# EAGLE design Servo_V1.0 (EAGLE 9.4.1)
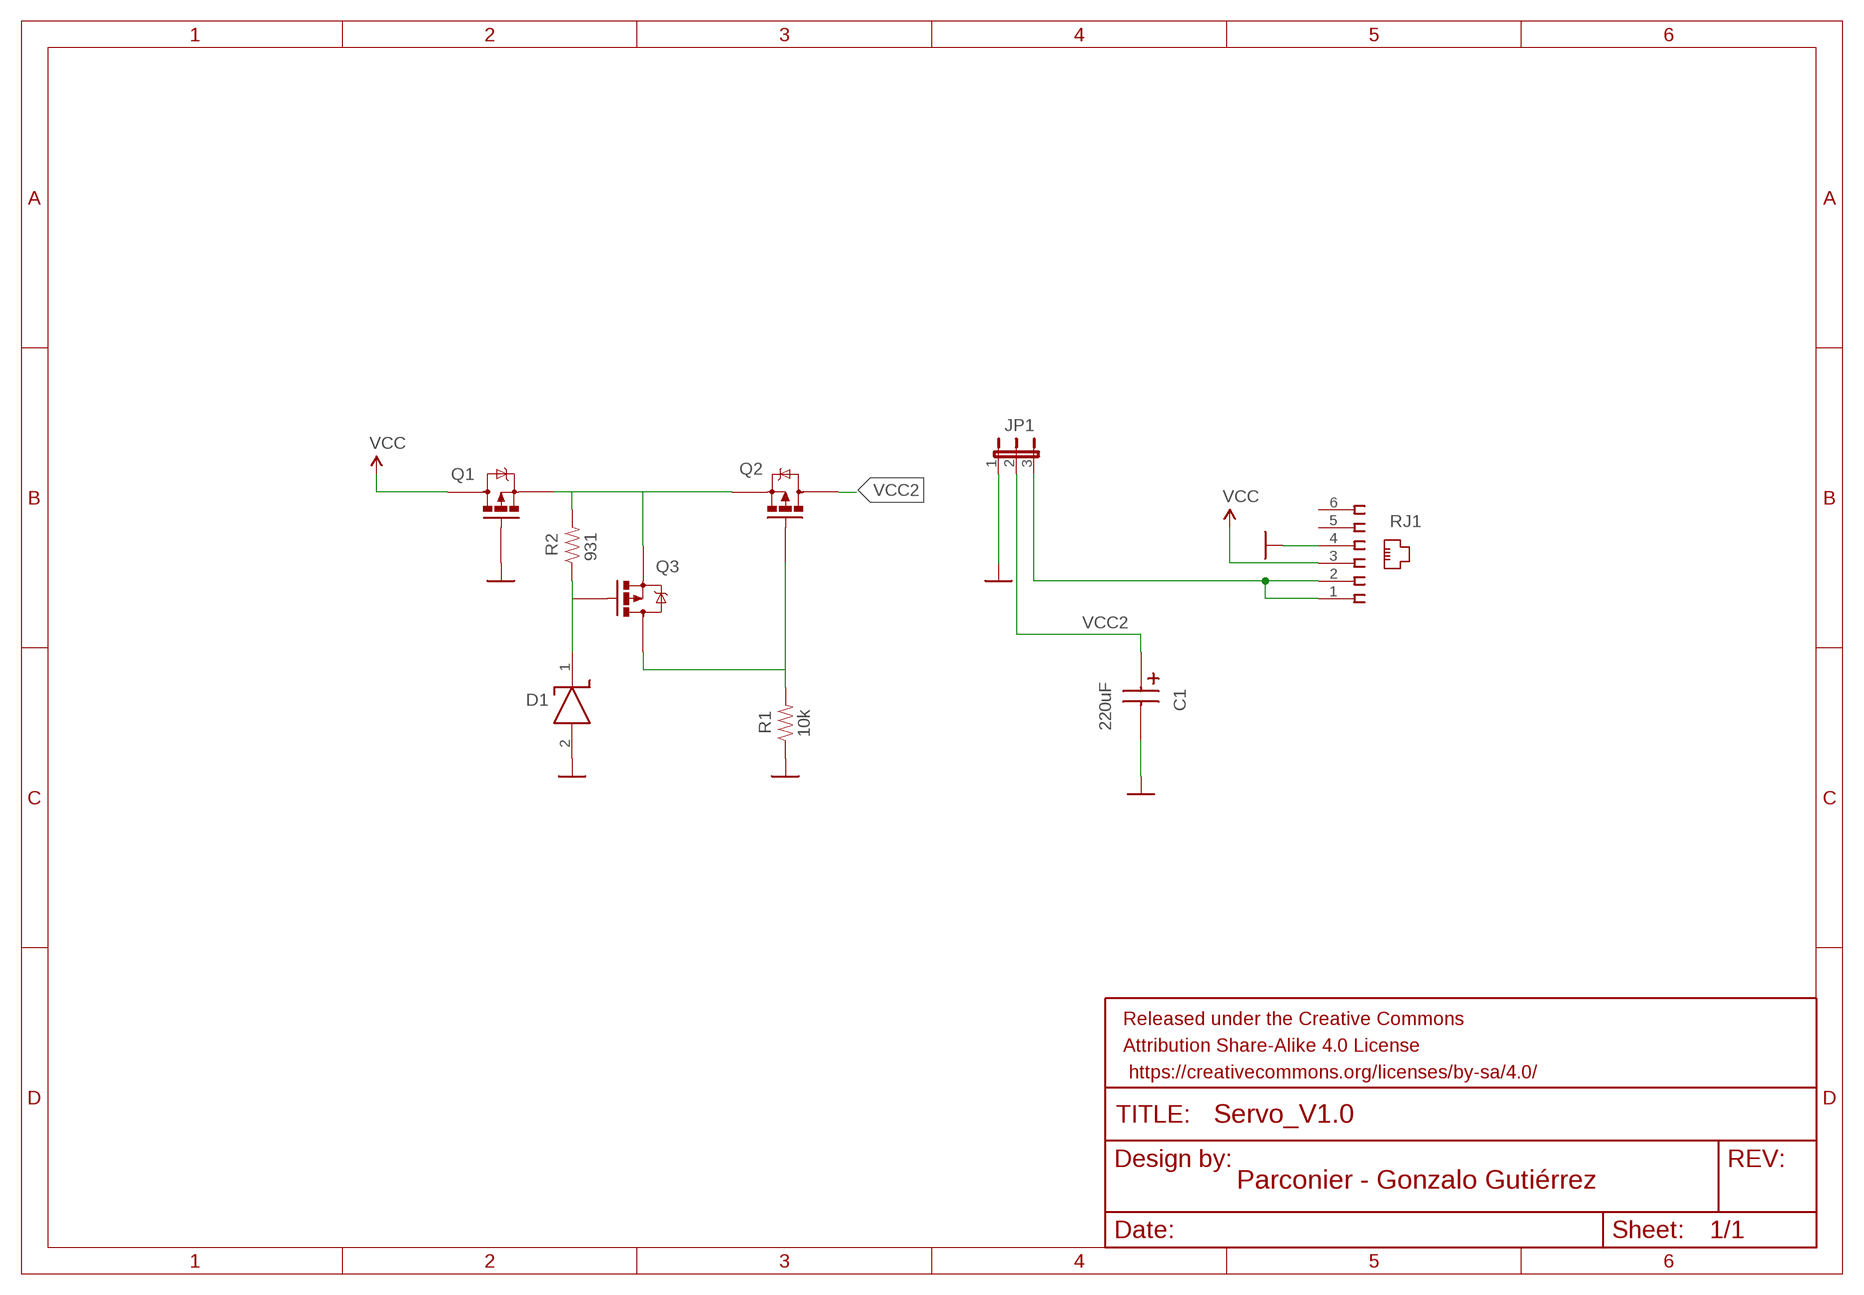
[diagram p0: schematic, sheet 1]

## Parts
C1  220uF  860010372006  [CAPPRD200W80D500H1100]
D1  BZT52C5V1-7-F  [SOD3716X145N]
JP1  JP2E  [JP2]
Q1  IRLML2244TRPBF  [SOT95P237X112-3N]
Q2  IRLML2244TRPBF  [SOT95P237X112-3N]
Q3  IRLML2244TRPBF  [SOT95P237X112-3N]
R1  10k  RES_0402  [RESC1005X35]
R2  931  RES_0402  [RESC1005X35]
RJ1  615006138421  [615006138421]

## Nets
GND: C1.2(-) D1.2(A) JP1.1 Q1.1(G) R1.1 RJ1.4
N$1: Q1.2(S) Q2.2(S) Q3.2(S) R2.2
N$2: Q2.1(G) Q3.3(D) R1.2
N$3: JP1.3 RJ1.1 RJ1.2
N$4: D1.1(K) Q3.1(G) R2.1
VCC: Q1.3(D) RJ1.3
VCC2: C1.1(+) JP1.2 Q2.3(D)
Unconnected: RJ1.5 RJ1.6

## Library data of the parts
C1 = 860010372006:860010372006: Wurth Elektronik 100uF 16 V dc Aluminium Electrolytic Capacitor, WCAP-ATG8 Series 2000h 5 (Dia.) x 11mm Source: Datasheet <http://uk.rs-online.com/web/p/products/1636051>; DESCRIPTION: Wurth Elektronik 100uF 16 V dc Aluminium Electrolytic Capacitor, WCAP-ATG8 Series 2000h 5 (Dia.) x 11mm; HEIGHT: 11mm; MANUFACTURER_NAME: Wurth Elektronik; MANUFACTURER_PART_NUMBER: 860010372006; MPN: 227CKS010M
D1 = BZT52C5V1-7-F:BZT52C5V1-7-F: Zener Diode 5.1V 5.8% 500mW SOD123 Diodes Inc BZT52C5V1-7-F Zener Diode, 5.1V 6% 0.5 W SMT 2-Pin SOD-123 Source: Datasheet <https://componentsearchengine.com/Datasheets/2/BZT52C5V1-7-F.pdf>; ALLIED_NUMBER: 71028127; ALLIED_PRICE/STOCK: https://www.alliedelec.com/diodes-inc-bzt52c5v1-7-f/71028127/; ARROW_PART_NUMBER: BZT52C5V1-7-F; ARROW_PRICE/STOCK: https://www.arrow.com/en/products/bzt52c5v1-7-f/diodes-incorporated; DESCRIPTION: Zener Diode 5.1V 5.8% 500mW SOD123 Diodes Inc BZT52C5V1-7-F Zener Diode, 5.1V 6% 0.5 W SMT 2-Pin SOD-123; HEIGHT: 1.45mm; MANUFACTURER_NAME: Diodes Inc.; MANUFACTURER_PART_NUMBER: BZT52C5V1-7-F; MPN: BZT52C5V1-7-F; RS_PART_NUMBER: 7384951P; RS_PRICE/STOCK: http://uk.rs-online.com/web/p/products/7384951P
JP1 = jump_byme:JP2E; MPN: 5-146284-3; SPICEPREFIX: J
Q1-Q3 = IRLML2244TRPBF:IRLML2244TRPBF: HEXFET Power MOSFET Source: Datasheet; ARROW_PART_NUMBER: IRLML2244TRPBF; DESCRIPTION: HEXFET Power MOSFET; HEIGHT: mm; MANUFACTURER_NAME: International Rectifier; MANUFACTURER_PART_NUMBER: IRLML2244TRPBF; MPN: IRLML2244TRPBF
R1 = Perfect_0402:RES_0402; MPN: RC0402JR-7W10KL
R2 = Perfect_0402:RES_0402; MPN: RC0402FR-07931RL
RJ1 = 615006138421:615006138421: HORIZONTAL PLASTIC 6P6C MODULAR JACK TAP UP Source: Datasheet <http://docs-europe.electrocomponents.com/webdocs/0f88/0900766b80f88670.pdf>; DESCRIPTION: HORIZONTAL PLASTIC 6P6C MODULAR JACK TAP UP; HEIGHT: mm; MANUFACTURER_NAME: W&uuml;rth Elektronik; MANUFACTURER_PART_NUMBER: 615006138421; MPN: 615006138421; RS_PART_NUMBER: 7350282; SUPPLIER_NAME: RS

## Net classes
0 default: width 0.254 mm, clearance 0.127 mm

## Board
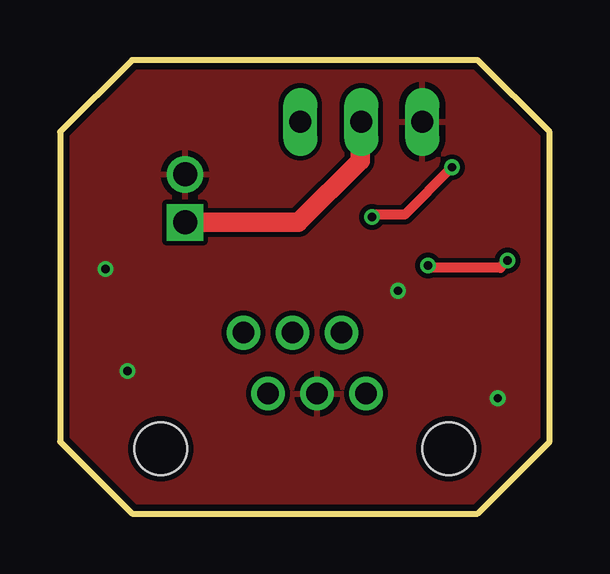
[diagram p1: board, top side]
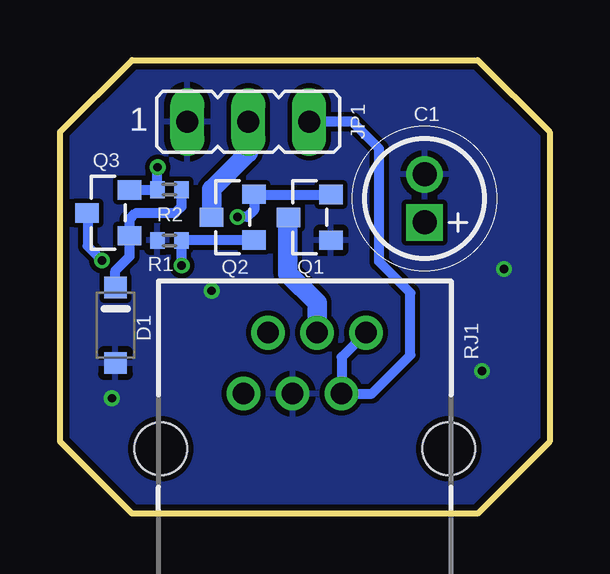
[diagram p2: board, bottom side, seen from below]

Size 20.4 x 18.9 mm. Coordinates in mm from the lower left corner, seen from the top.
Outline: 0,15.9 0,3 3,0 17.4,0 20.4,3 20.4,15.9 17.4,18.9 3,18.9 0,15.9
Copper layers (1*16): Top 0.035mm / dielectric 1.5mm / Bottom 0.035mm
Design rules "SeeedStudio_2layer_DRU_no_angle_20140221": minimum track width 6mil, minimum drill 12mil, track to track 6mil, track to pad 6mil, pad to pad 6mil, via to via 6mil, smd to smd 0mil, copper to edge 10mil, drill to drill 10mil, minimum pad ring 10mil, minimum via ring 6mil, stop-mask expansion 2mil, vias tented up to drill 100mil, thermal gap 10mil

### Footprints (pad centres in the part's own frame; a part is rotated, then mirrored left to right if it is on the bottom)
CAPPRD200W80D500H1100 = drill 1 pad 1.5 square: 1 0,0 | drill 1 pad 1.5: 2 2,0
SOD3716X145N = smd 0.9 x 0.95: 1 -1.575,0; 2 1.575,0
JP2 = drill 0.914 long: 1 -2.54,0; 2 0,0; 3 2.54,0
SOT95P237X112-3N = smd 0.972 x 0.802: 1 -0.885,0.95; 2 -0.885,-0.95; 3 0.885,0
RESC1005X35 = smd 0.6 x 0.7: 1 -0.5,0; 2 0.5,0
615006138421 = drill 0.9 pad 1.4: 1 2.55,4.84; 2 1.53,2.3; 3 0.51,4.84; 4 -0.51,2.3; 5 -1.53,4.84; 6 -2.55,2.3 | hole 2.2: -6,0; 6,0

### Placement (x,y rotation side)
C1  5.21,12.13 90 bottom
D1  18.09,7.85 270 bottom
JP1  12.55,16.32 0 bottom
Q1  9.99,12.34 180 bottom
Q2  13.2,12.35 180 bottom
Q3  18.39,12.53 180 bottom
R1  15.84,11.38 0 bottom
R2  15.84,13.5 180 bottom
RJ1  10.2,2.7 0 bottom

### Tracks (layer width: path | path; a pad name or v marks a point on that pad's centre or on a via)
GND  (via drill 0.35)
  other vias: 2.82,5.95 14.08,9.29 1.9,10.19 18.24,4.8
  pour Top (isolate 0.2): 0,18.9 20.4,18.9 20.4,0 0,0
  pour Bottom (isolate 0.2): 0,18.9 0,0 20.4,0 20.4,18.9
N$1  (via drill 0.35)
  Top 0.406: v13,12.36 13.1,12.46 14.36,12.46 v16.33,14.43
  Bottom 0.406: Q1.2 12.31,13.29 Q2.2 12.32,12.64 12.6,12.36 v13,12.36 | R2.2 v16.34,14.42 v16.33,14.43 | Q3.2 17.48,13.5 R2.2 | R2.2
N$2  (via drill 0.35)
  Top 0.406: v15.33,10.34 15.43,10.24 18.35,10.24 v18.65,10.54
  Bottom 0.406: Q2.1 12.34,11.38 R1.2 v15.34,10.35 v15.33,10.34 | v18.65,10.54 19.25,11.14 19.25,12.51 Q3.3
N$3
  Bottom 0.406: JP1.3 8.22,16.32 7.1,15.2 7.1,10.5 5.8,9.2 5.8,6.6 7.4,5 RJ1.2 8.67,6.52 RJ1.1
N$4
  Bottom 0.406: D1.1 18.09,10.12 17.5,10.72 Q3.1 17.52,11.6 17.52,12.25 17.26,12.51 15.61,12.51 15.34,12.78 R2.1 | R2.1
VCC
  Bottom 0.813: RJ1.3 9.69,8.79 10.9,10 10.9,12.32 Q1.3
VCC2
  Top 0.813: C1.1 9.93,12.13 12.5,14.7 12.5,16.27 JP1.2
  Bottom 0.813: Q2.3 14.09,13.51 12.55,15.04 JP1.2